# Altium schematic sheet Lab03_Prelab.SchDoc: Document Title
size 223 x 172 mm; DrawnBy: Student; Revision: A1
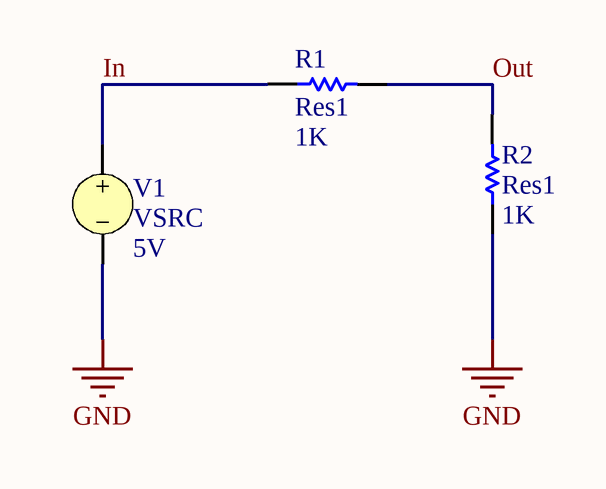
[diagram p0: Lab03_Prelab.SchDoc]

## Parts
R1  Res1  value 1K  [AXIAL-0.3]
R2  Res1  value 1K  [AXIAL-0.3]
V1  VSRC  value 5V

## Nets
GND: R2.1 V1.2
In: R1.1 V1.1
Out: R1.2 R2.2

## Notes on the sheet
- Drawn by:
- Date:
- Revision:
- Sheet
- of
- File:
- Size:
- 0.8*Letter
- School of Engineering & Computer Science

## Library data of the parts
R1 R2 = Res1: Resistor; Published: 8-Jun-2000; LatestRevisionDate: 17-Jul-2002; LatestRevisionNote: Re-released for DXP Platform.; PackageReference: AXIAL-0.3; Publisher: Altium Limited; PackageDescription: Axial Device, Thru-Hole; 2 Leads; 0.3 in Pin Spacing
V1 = VSRC: Voltage Source; Note: PCB Footprint - Not required; Published: 8-Jun-2000; LatestRevisionDate: 17-Jul-2002; LatestRevisionNote: Re-released for DXP Platform.; PackageReference: Not Applicable; Publisher: Altium Limited